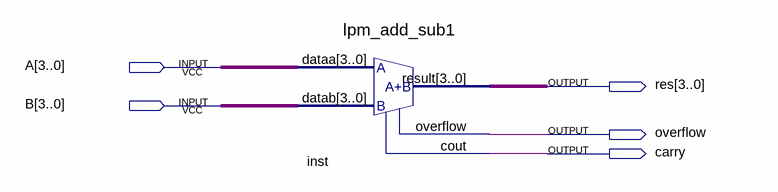
[diagram p0: schematic sheet]
// Quartus schematic tstAdd.bdf as structural Verilog: 1 symbols, 5 pins
module tstAdd (
  input  [3:0] A,
  input  [3:0] B,
  output [3:0] res,
  output overflow,
  output carry
);

  lpm_add_sub1 inst (.dataa(A), .datab(B), .result(res), .overflow(overflow), .cout(carry));
endmodule
